# EAGLE design CAN-Simulator_v1 (EAGLE 7.5.0)
DATABASE: /home/monkbroc/Electronics/eagle/PARTSDB.tsv
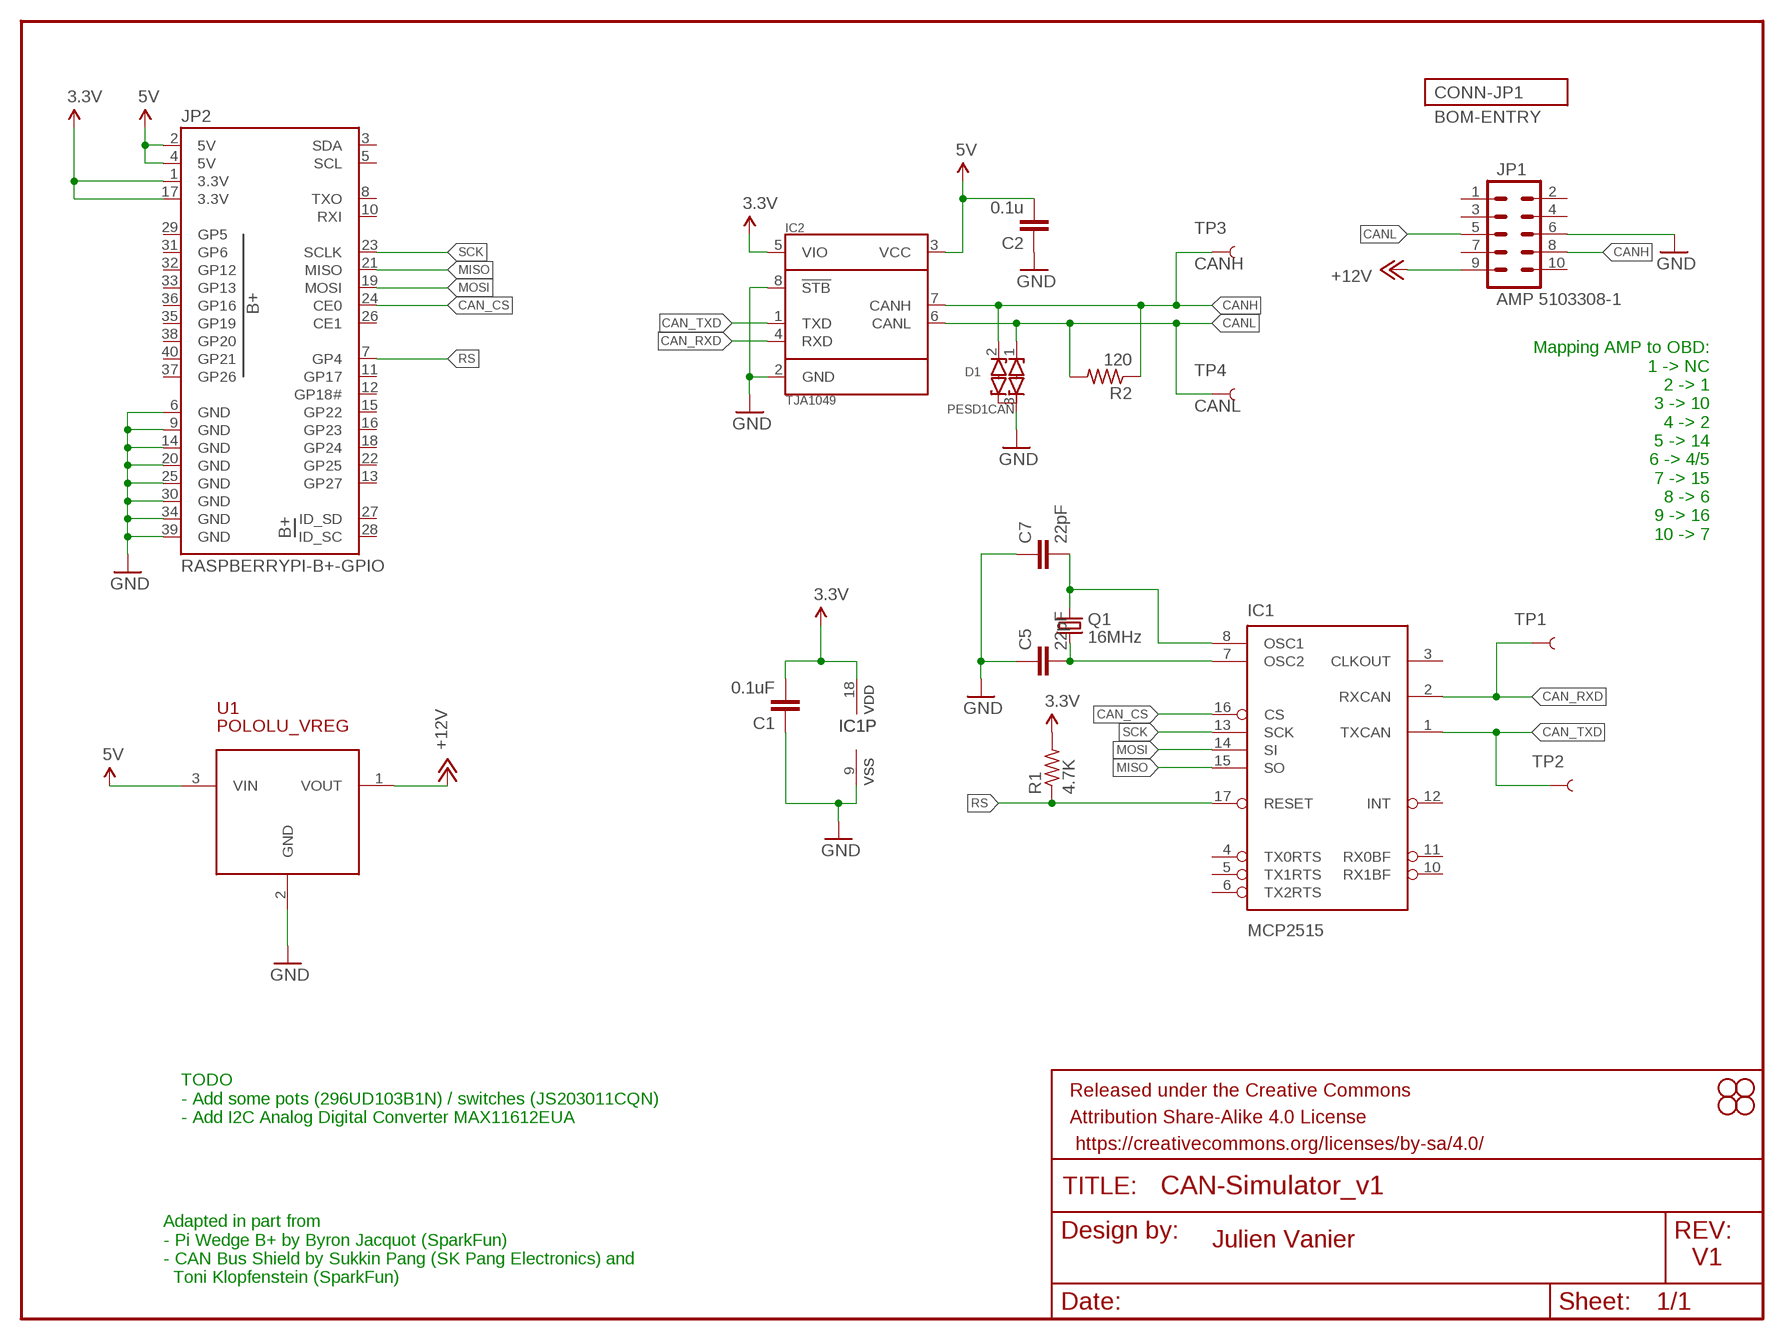
[diagram p0: schematic, sheet 1]
CONN-JP1 (BOM-ENTRY): PARTNO: 1658621-1

## Parts
C1  0.1uF  C-EUC0805  [C0805]
C2  0.1u  C-EUC0805  [C0805]
C5  22pF  C-EUC0805  [C0805]
C7  22pF  C-EUC0805  [C0805]
D1  PESD1CAN  DIODE_ESD_DUAL-SOT-23  [SOT23]
FRAME1  FRAME-LETTER  [CREATIVE_COMMONS]
IC1  MCP2515  MCP2510SO  [SO-18W]
IC2  TJA1049  [SO8]
JP1  AMP 5103308-1  M05X2SHD  [2X5-SHROUDED]
JP2  RASPBERRYPI-B+-GPIO  [2X20-SHROUDED]
Q1  16MHz  CRYSTAL5X3  [CRYSTAL-SMD-5X3]
R1  4.7K  R-US_R0805  [R0805]
R2  120  R-US_R0805  [R0805]
STANDOFF1  STAND-OFFSCREW-2  [STAND-OFF-2]
STANDOFF2  STAND-OFFSCREW-2  [STAND-OFF-2]
STANDOFF3  STAND-OFFSCREW-2  [STAND-OFF-2]
STANDOFF4  STAND-OFFSCREW-2  [STAND-OFF-2]
TP1  TEST-POINT3X5  [PAD.03X.05]
TP2  TEST-POINT3X5  [PAD.03X.05]
TP3  CANH  TEST-POINT3  [PAD.03X.03]
TP4  CANL  TEST-POINT3  [PAD.03X.03]
U1  POLOLU_VREG  [POLOLU_VREG]

## Nets
3.3V: C1.2 IC1.18(VDD) IC2.5(VIO) JP2.1(3.3V) JP2.17(3.3V) R1.2
5V [power]: C2.2 IC2.3(VCC) JP2.2(5V) JP2.4(5V) U1.3(VIN)
+12V [power]: JP1.9 U1.1(VOUT)
CAN_CS: IC1.16(CS) JP2.24(CE0)
CAN_RXD: IC1.2(RXCAN) IC2.4(RXD) TP1.P$1
CAN_TXD: IC1.1(TXCAN) IC2.1(TXD) TP2.P$1
CANH: D1.2(C2) IC2.7(CANH) JP1.8 R2.1 TP3.P$1
CANL: D1.1(C1) IC2.6(CANL) JP1.5 R2.2 TP4.P$1
GND [power]: C1.1 C2.1 C5.1 C7.1 D1.3(COM) IC1.9(VSS) IC2.2(GND) IC2.8(!STB) JP1.6 JP2.6(GND) JP2.9(GND) JP2.14(GND) JP2.20(GND) JP2.25(GND) JP2.30(GND) JP2.34(GND) JP2.39(GND) U1.2(GND)
MISO: IC1.15(SO) JP2.21(MISO)
MOSI: IC1.14(SI) JP2.19(MOSI)
N$17: C7.2 IC1.8(OSC1) Q1.3
N$18: C5.2 IC1.7(OSC2) Q1.1
RS: IC1.17(RESET) JP2.7(GP4) R1.1
SCK: IC1.13(SCK) JP2.23(SCLK)
Unconnected: IC1.3(CLKOUT) IC1.4(TX0RTS) IC1.5(TX1RTS) IC1.6(TX2RTS) IC1.10(RX1BF) IC1.11(RX0BF) IC1.12(INT) JP1.1 JP1.2 JP1.3 JP1.4 JP1.7 JP1.10 JP2.3(SDA) JP2.5(SCL) JP2.8(TXO) JP2.10(RXI) JP2.11(GP17) JP2.12(GP18#) JP2.13(GP27) JP2.15(GP22) JP2.16(GP23) JP2.18(GP24) JP2.22(GP25) JP2.26(CE1) JP2.27(ID_SD) JP2.28(ID_SC) JP2.29(GP5) JP2.31(GP6) JP2.32(GP12) JP2.33(GP13) JP2.35(GP19) JP2.36(GP16) JP2.37(GP26) JP2.38(GP20) JP2.40(GP21)

## Notes on the sheet
- Mapping AMP to OBD:
  1 -> NC
  2 -> 1
  3 -> 10
  4 -> 2
  5 -> 14
  6 -> 4/5
  7 -> 15
  8 -> 6
  9 -> 16
  10 -> 7
- TODO
  - Add some pots (296UD103B1N) / switches (JS203011CQN)
  - Add I2C Analog Digital Converter MAX11612EUA
- Julien Vanier
- V1
- Adapted in part from
  - Pi Wedge B+ by Byron Jacquot (SparkFun)
  - CAN Bus Shield by Sukkin Pang (SK Pang Electronics) and
    Toni Klopfenstein (SparkFun)

## Library data of the parts
C1 C2 = rcl:C-EU: CAPACITOR, European symbol; PARTNO: 08055C104KAT2A
C5 C7 = rcl:C-EU: CAPACITOR, European symbol; PARTNO: C0805C220J5GACTU
D1 = MuniRent:DIODE_ESD_DUAL: Dual ESD Diode, with a common anode; PARTNO: PESD1CAN-215
FRAME1 = SparkFun-Aesthetics:FRAME-LETTER: Schematic Frame Standard 8.5x11 US Letter frame; BOM: EXCLUDE
IC1 = SparkFun-DigitalIC:MCP2510: CAN controller with SPI interface to any MCU. Original design by Microchip.; PARTNO: MCP2515-I/SO; PROD_ID: IC-09906
IC2 = MuniRent:TJA1049; PARTNO: TJA1049T-118
JP1 = SparkFun-Connectors:M05X2: Header 5x2 Standard 10-pin dual row 0.1" header. Commonly used with AVR-ISP. Use with Spark Fun Electronics SKU: PRT-00778; PARTNO: 5103308-1
JP2 = SparkFun-Boards:RASPBERRYPI-B+-GPIO: Raspberry Pi B+ GPIO Header 2x20 pin connector
Q1 = SparkFun-FreqCtrl:CRYSTAL: Various standard crystals. Proven footprints.; PARTNO: ABM3B-16.000MHZ-10-1-U-T; PROD_ID: XTAL-08218
R1 = rcl:R-US_: RESISTOR, American symbol; PARTNO: RC0805JR-0747KL
R2 = rcl:R-US_: RESISTOR, American symbol; PARTNO: RC0603FR-07120RL
STANDOFF1-STANDOFF4 = SparkFun-Electromechanical:STAND-OFF: #4 Stand Off This is the mechanical footprint for a #4 phillips button head screw. Use the keepout ring to avoid running the screw head into surrounding components. SKU : PRT-00447
TP1-TP4 = SparkFun-Passives:TEST-POINT: Bare copper test points for troubleshooting or ICT; BOM: EXCLUDE
U1 = MuniRent:POLOLU_VREG

## Net classes
0 default: width 0.254 mm
1 power: width 0.813 mm, clearance 0.406 mm

## Board
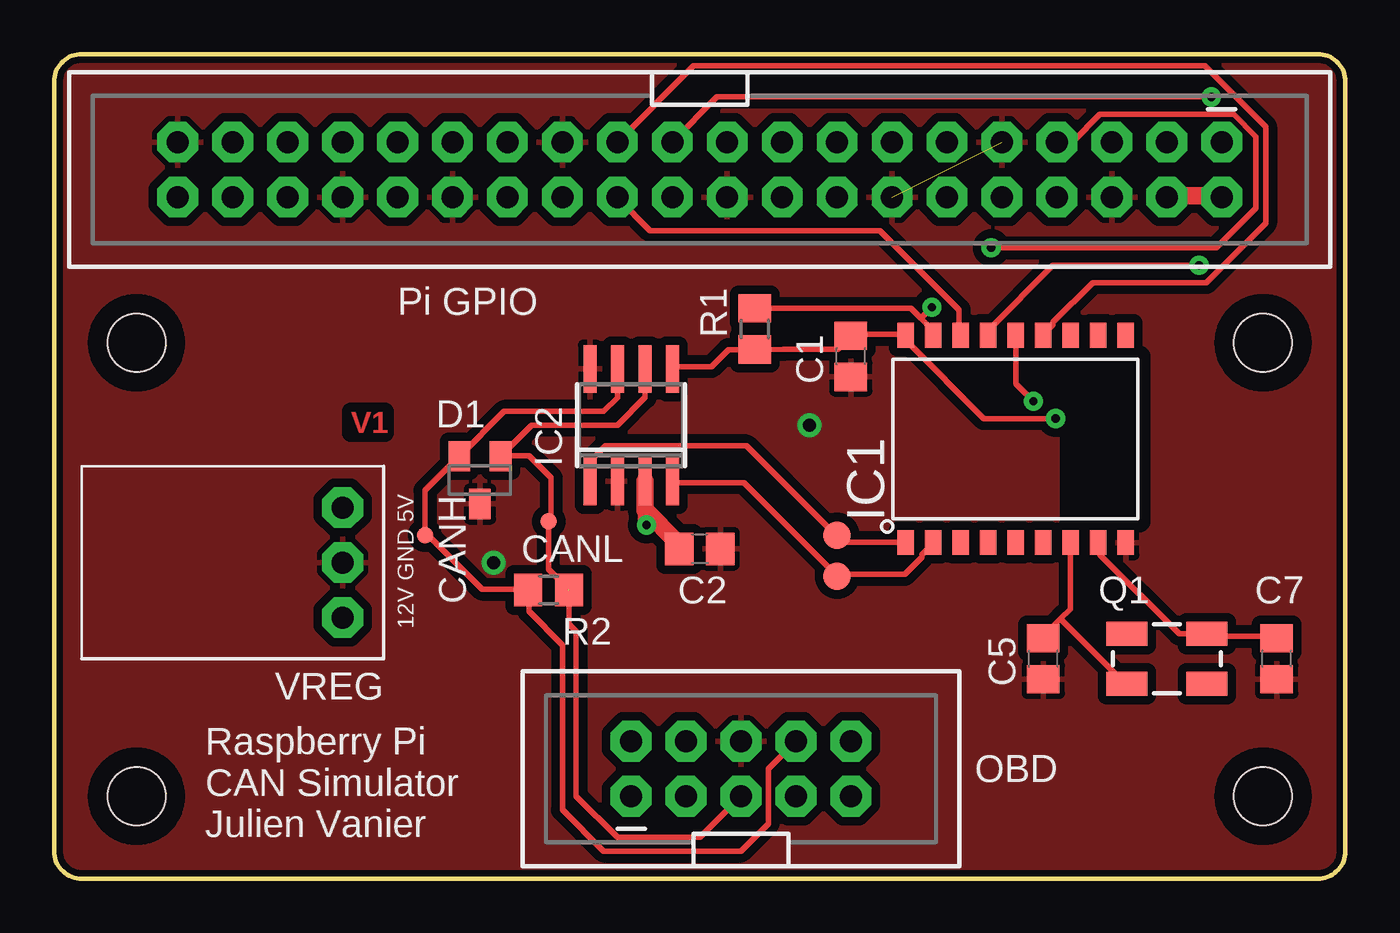
[diagram p1: board, top side]
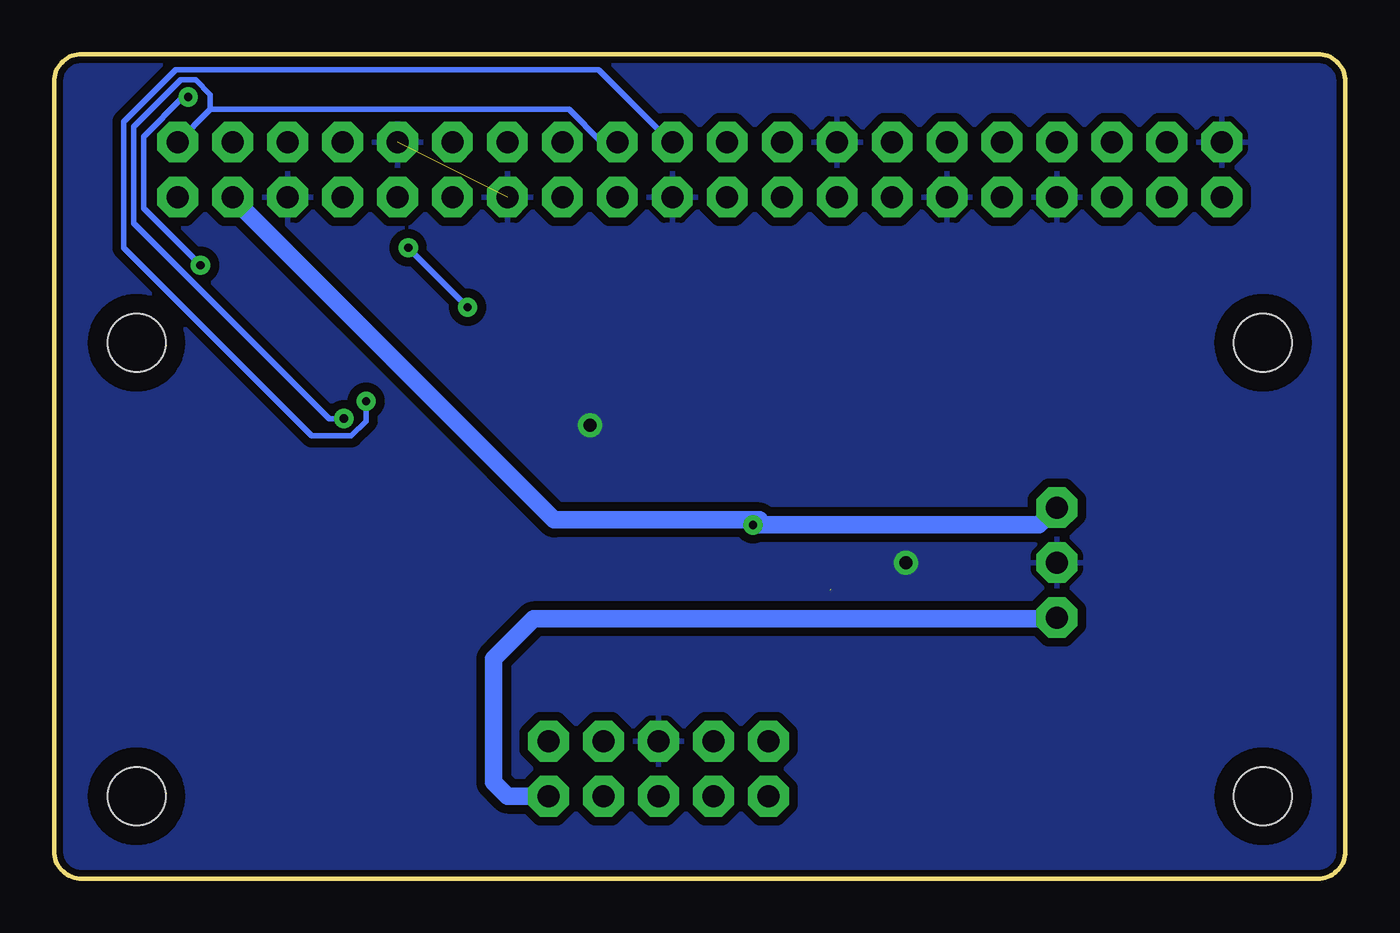
[diagram p2: board, bottom side, seen from below]

Size 59.69 x 38.1 mm. Coordinates in mm from the lower left corner, seen from the top.
Outline: 0,36.83 0,1.27 arc90 1.27,0 58.42,0 arc90 59.69,1.27 59.69,36.83 arc90 58.42,38.1 1.27,38.1 arc90 0,36.83
Copper layers (1*16): Top 0.035mm / dielectric 1.5mm / Bottom 0.035mm
Design rules "SparkFun-2-layer *": minimum track width 7mil, minimum drill 15mil, track to track 8mil, track to pad 8mil, pad to pad 8mil, via to via 8mil, smd to smd 8mil, copper to edge 8mil, drill to drill 8mil, minimum pad ring 12mil, minimum via ring 10mil, stop-mask expansion 4mil, vias tented up to drill 20mil, thermal gap 10mil
tRestrict: area 47,16.5 to 50.2,24.1

### Footprints (pad centres in the part's own frame; a part is rotated, then mirrored left to right if it is on the bottom)
C0805 = smd 1.3 x 1.5: 1 -0.95,0; 2 0.95,0
SOT23 = smd 1 x 1.4: 1 -0.95,-1.1; 2 0.95,-1.1; 3 0,1.1
SO-18W = smd 0.762 x 1.143: 1 -5.08,-4.788; 2 -3.81,-4.788; 3 -2.54,-4.788; 4 -1.27,-4.788; 5 0,-4.788; 6 1.27,-4.788; 7 2.54,-4.788; 8 3.81,-4.788; 9 5.08,-4.788; 10 5.08,4.788; 11 3.81,4.788; 12 2.54,4.788; 13 1.27,4.788; 14 0,4.788; 15 -1.27,4.788; 16 -2.54,4.788; 17 -3.81,4.788; 18 -5.08,4.788
SO8 = smd 0.6 x 2.2: 1 -1.905,-2.6; 2 -0.635,-2.6; 3 0.635,-2.6; 4 1.905,-2.6; 5 1.905,2.6; 6 0.635,2.6; 7 -0.635,2.6; 8 -1.905,2.6
2X5-SHROUDED = drill 1.016 pad 1.88 octagon: 1 -1.27,5.08; 2 1.27,5.08; 3 -1.27,2.54; 4 1.27,2.54; 5 -1.27,0; 6 1.27,0; 7 -1.27,-2.54; 8 1.27,-2.54; 9 -1.27,-5.08; 10 1.27,-5.08
2X20-SHROUDED = drill 1.016 pad 1.88 octagon: 1 -1.27,24.13; 2 1.27,24.13; 3 -1.27,21.59; 4 1.27,21.59; 5 -1.27,19.05; 6 1.27,19.05; 7 -1.27,16.51; 8 1.27,16.51; 9 -1.27,13.97; 10 1.27,13.97; 11 -1.27,11.43; 12 1.27,11.43; 13 -1.27,8.89; 14 1.27,8.89; 15 -1.27,6.35; 16 1.27,6.35; 17 -1.27,3.81; 18 1.27,3.81; 19 -1.27,1.27; 20 1.27,1.27; 21 -1.27,-1.27; 22 1.27,-1.27; 23 -1.27,-3.81; 24 1.27,-3.81; 25 -1.27,-6.35; 26 1.27,-6.35; 27 -1.27,-8.89; 28 1.27,-8.89; 29 -1.27,-11.43; 30 1.27,-11.43; 31 -1.27,-13.97; 32 1.27,-13.97; 33 -1.27,-16.51; 34 1.27,-16.51; 35 -1.27,-19.05; 36 1.27,-19.05; 37 -1.27,-21.59; 38 1.27,-21.59; 39 -1.27,-24.13; 40 1.27,-24.13
CRYSTAL-SMD-5X3 = smd 1.9 x 1.1: 1 -1.85,-1.15; 2 1.85,-1.15; 3 1.85,1.15; 4 -1.85,1.15
R0805 = smd 1.3 x 1.5: 1 -0.95,0; 2 0.95,0
STAND-OFF-2 = hole 2.667: 0,0
PAD.03X.05 = smd 1.27 x 1.27: P$1 0,0
PAD.03X.03 = smd 0.762 x 0.762: P$1 0,0
POLOLU_VREG = drill 1.016 pad 1.88 octagon: 1 0,0; 2 2.54,0; 3 5.08,0

### Placement (x,y rotation side)
C1  36.83,24.13 90 top
C2  29.84,15.24 180 top
C5  45.72,10.16 90 top
C7  56.52,10.16 90 top
D1  19.68,18.41 180 top
FRAME1  8.89,-16.51 0 top  (outside the outline)
IC1  44.45,20.32 0 top
IC2  26.67,20.95 0 top
JP1  31.75,5.08 90 top
JP2  29.84,32.77 270 top
Q1  51.44,10.16 0 top
R1  32.38,25.4 270 top
R2  22.86,13.34 0 top
STANDOFF1  3.81,24.77 0 top
STANDOFF2  55.88,24.77 0 top
STANDOFF3  55.88,3.81 0 top
STANDOFF4  3.81,3.81 0 top
TP1  36.2,13.97 0 top
TP2  36.2,15.88 0 top
TP3  17.14,15.88 0 top
TP4  22.86,16.51 0 top
U1  13.34,12.06 90 top

### Tracks (layer width: path | path; a pad name or v marks a point on that pad's centre or on a via)
3.3V  (via drill 0.38)
  Top 0.254: IC2.5 28.57,23.66 30.38,23.66 31.17,24.45 R1.2 33.72,24.46 36.23,24.46 36.8,25.03 C1.2 36.92,25.15 39.32,25.15 IC1.18 39.43,25.03 39.43,24.8 42.98,21.26 v46.29,21.26 | 54.06,34.06 JP2.1
  Bottom 0.254: 52.46,35.55 35.89,35.55 34.4,34.06 33.72,34.06 JP2.17 | JP2.1 52.46,35.55 | v46.29,21.26 46.98,21.26 56.01,30.29 56.01,34.75 53.84,36.92 53.15,36.92 52.46,36.23 52.46,35.55
5V  (via drill 0.38)
  Top 0.813: JP2.4 51.44,31.55 53.95,31.55 JP2.2 54.06,31.55 | 27.38,16.97 27.32,17.03 27.32,18.29 IC2.3 | 27.38,16.97 28.8,15.54 28.8,15.32 C2.2 | v27.38,16.34 27.38,16.97
  Bottom 0.813: U1.3 13.37,17.14 14.17,16.34 v27.38,16.34 27.09,16.57 36.58,16.57 51.44,31.43 JP2.4
+12V
  Bottom 0.813: U1.1 13.37,12 37.53,12 39.37,10.16 39.37,4.45 38.73,3.81 JP1.9
CAN_CS
  Top 0.254: IC1.16 41.83,25.15 41.83,26.29 38.18,29.95 27.55,29.95 26.06,31.43 JP2.24
CAN_RXD
  Top 0.254: IC1.2 40.58,15.43 40.12,14.97 40.12,14.86 39.32,14.06 36.23,14.06 TP1.P$1 36.12,14.06 31.89,18.29 28.57,18.29 IC2.4
CAN_TXD
  Top 0.254: IC1.1 39.32,15.54 36.46,15.54 36.23,15.77 TP2.P$1 36.12,15.89 32,20 25.49,20 24.8,19.32 24.8,18.4 IC2.1
CANH
  Top 0.254: IC2.7 26.04,22.23 25.4,21.59 20.81,21.59 D1.2 18.63,19.43 17.14,17.95 TP3.P$1 17.26,15.89 19.77,13.37 21.83,13.37 R2.1 21.95,13.26 21.95,12.34 23.5,10.79 23.5,3.17 25.4,1.27 31.75,1.27 33.02,2.54 33.02,5.08 JP1.8
CANL  (1 unrouted)
  Top 0.254: 23.77,13.37 22.86,14.29 TP4.P$1 22.97,16.57 22.97,18.52 21.95,19.55 20.69,19.55 D1.1 22.07,20.95 26.04,20.95 27.32,22.24 27.32,23.43 IC2.6 27.2,23.66 27.2,24.35 | R2.2 23.81,11.75 24.13,11.43 24.13,3.81 26.04,1.91 29.84,1.91 JP1.5
GND  (via drill 0.6)  (1 unrouted)
  other vias: 20.32,14.61 34.92,20.95
  pour Bottom (isolate 0.305): 0,36.83 0,1.27 arc90 1.27,0 58.42,0 arc90 59.69,1.27 59.69,36.83 arc90 58.42,38.1 1.27,38.1 arc90
  pour Top (isolate 0.305): 58.42,0 1.27,0 arc-90 0,1.27 0,36.83 arc-90 1.27,38.1 58.42,38.1 arc-90 59.69,36.83 59.69,1.27 arc-90
MISO  (via drill 0.38)
  Top 0.254: v52.92,28.35 46.18,28.35 43.2,25.38 43.2,25.15 IC1.15 | v53.49,36.12 30.63,36.12 28.57,34.06 JP2.21
  Bottom 0.254: v52.92,28.35 55.55,30.98 55.55,34.29 53.72,36.12 v53.49,36.12
MOSI  (via drill 0.38)
  Top 0.254: v45.26,22.06 44.46,22.86 44.46,25.03 IC1.14
  Bottom 0.254: v45.26,22.06 45.26,21.14 45.95,20.46 47.78,20.46 56.46,29.15 56.46,34.98 54.06,37.38 34.52,37.38 31.2,34.06 JP2.19
N$17
  Top 0.254: IC1.8 48.35,15.43 48.35,14.97 52.01,11.32 53.26,11.32 Q1.3 53.38,11.2 56.46,11.2 C7.2
N$18
  Top 0.254: 46.52,12 45.72,11.2 C5.2 | 46.52,12 46.98,12.46 46.98,15.43 IC1.7 | 46.52,12 49.49,9.03 Q1.1
RS  (via drill 0.38)
  Top 0.254: 40.06,25.89 39.6,26.35 R1.1 | 40.06,25.89 40.58,25.38 40.58,25.15 IC1.17 | v43.32,29.15 53.72,29.15 55.55,30.98 55.55,34.29 54.52,35.32 48.35,35.32 47.09,34.06 46.41,34.06 JP2.7 | 40.06,25.89 v40.58,26.4
  Bottom 0.254: v40.58,26.4 v43.32,29.15
SCK
  Top 0.254: JP2.23 29.55,37.55 53.2,37.55 56.01,34.75 56.01,30.29 53.26,27.55 48.01,27.55 46.18,25.72 46.18,25.6 45.72,25.15 IC1.13

### Text on the board
Top: V1
tPlace: Pi GPIO | 12V GND 5V | CANL | CANH | VREG | OBD | Raspberry Pi / CAN Simulator / Julien Vanier